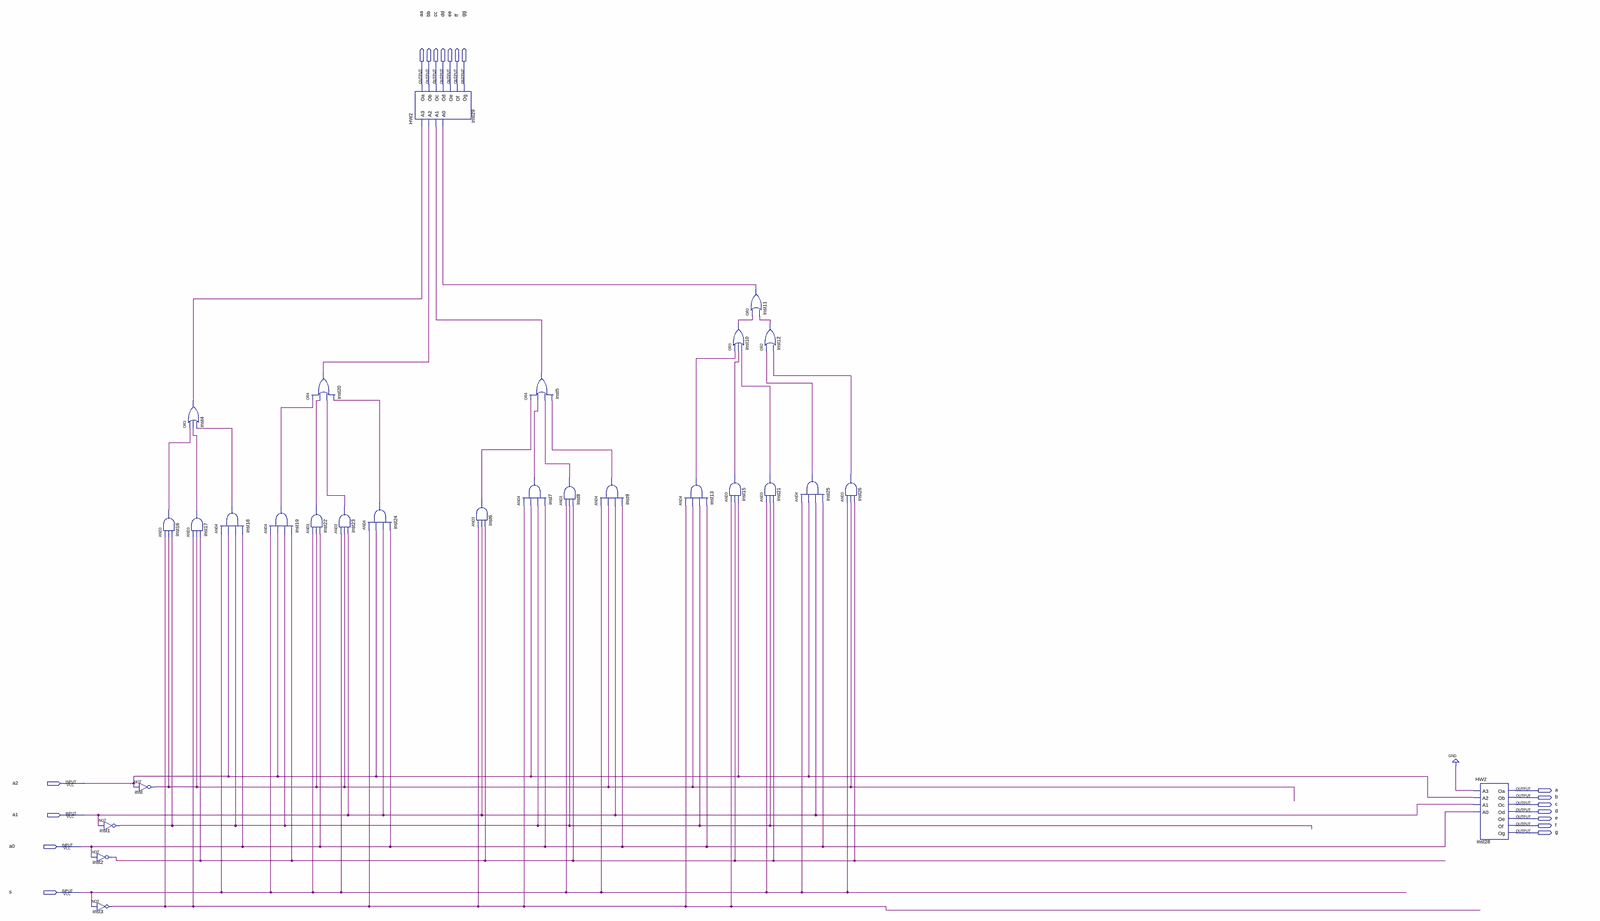
[diagram p0: schematic sheet, whole]
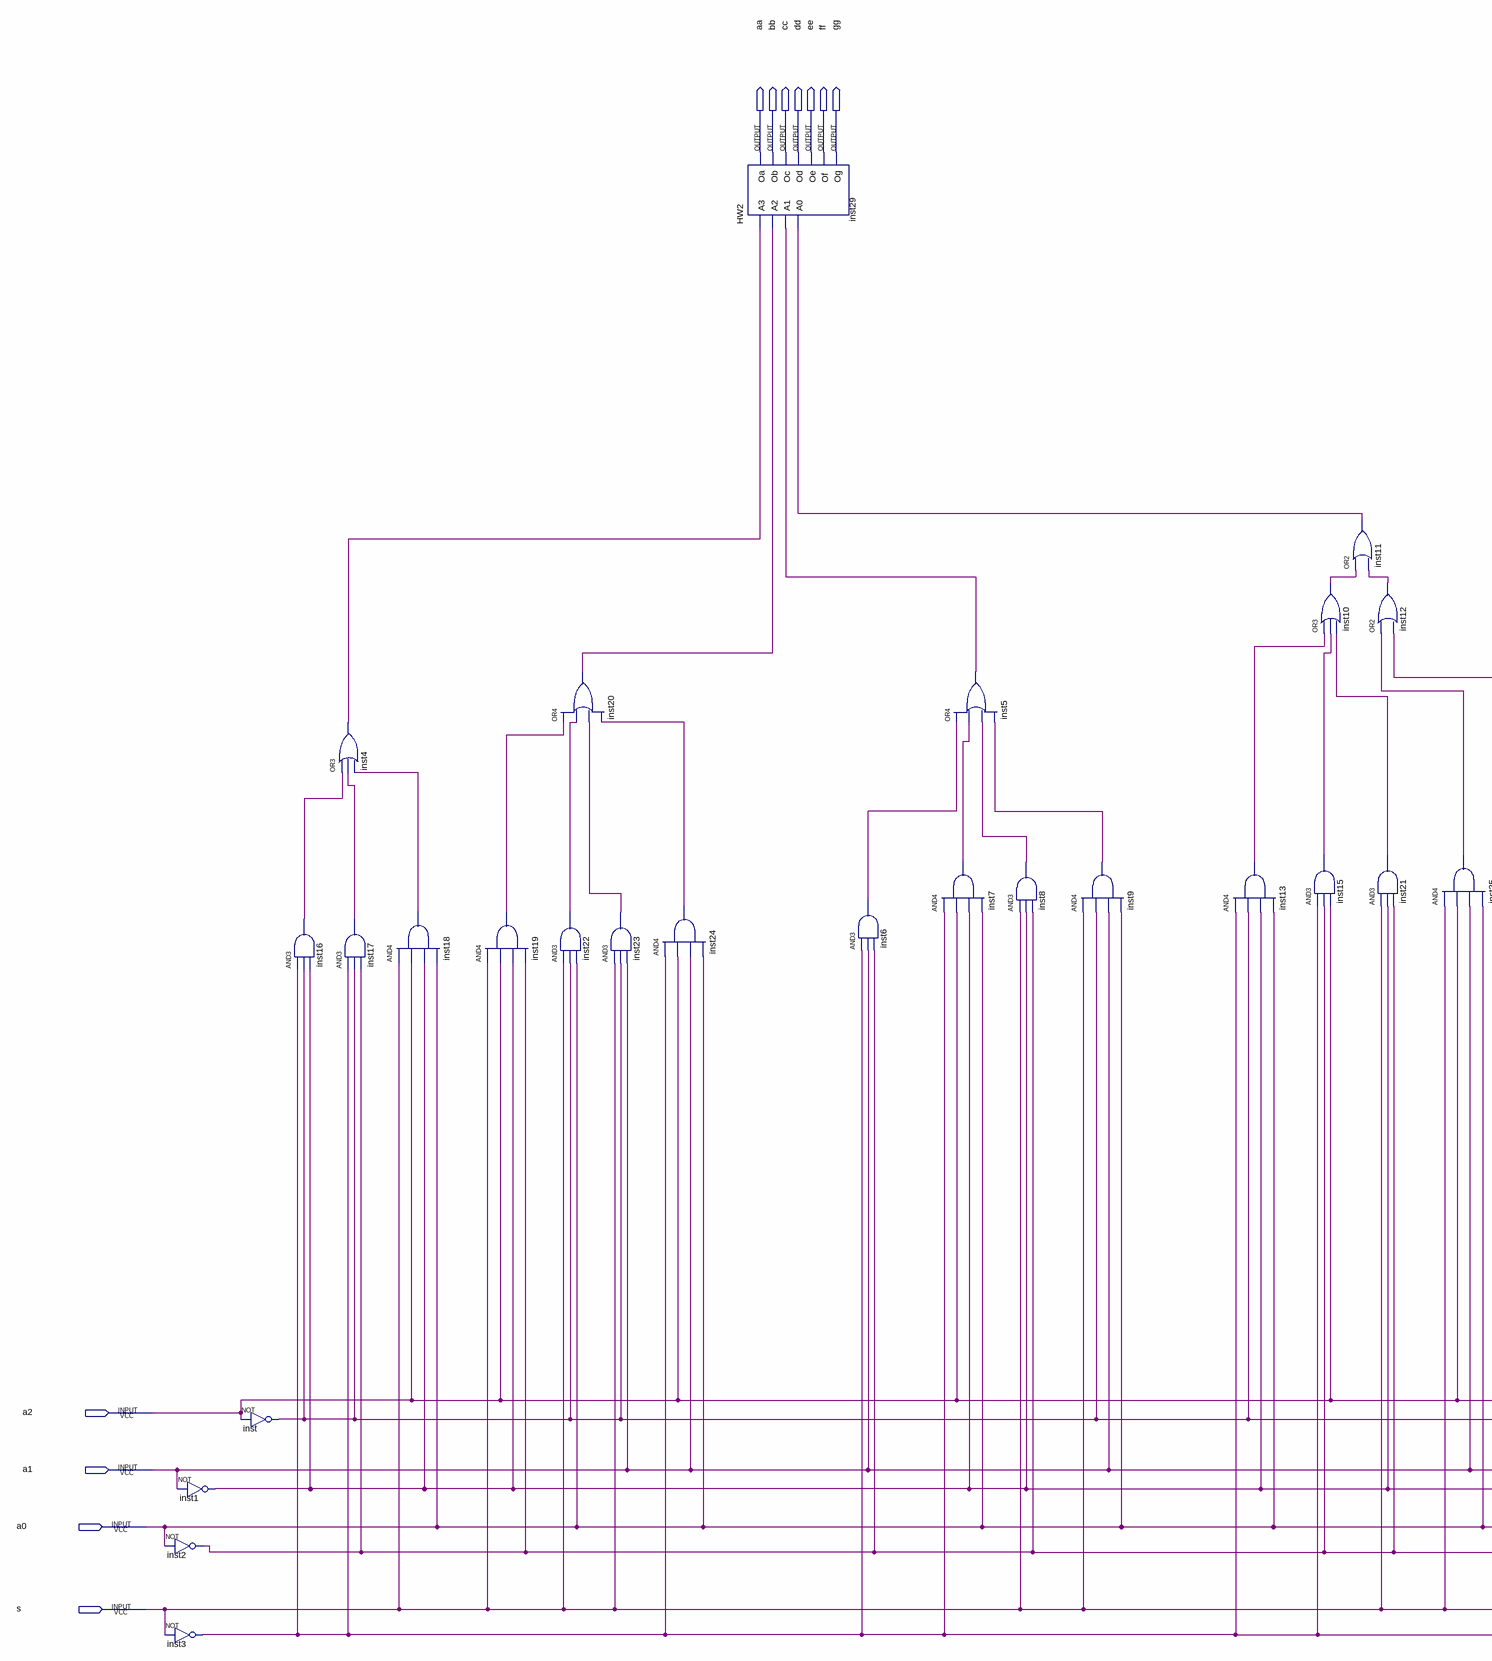
[diagram p1: schematic sheet, left part]
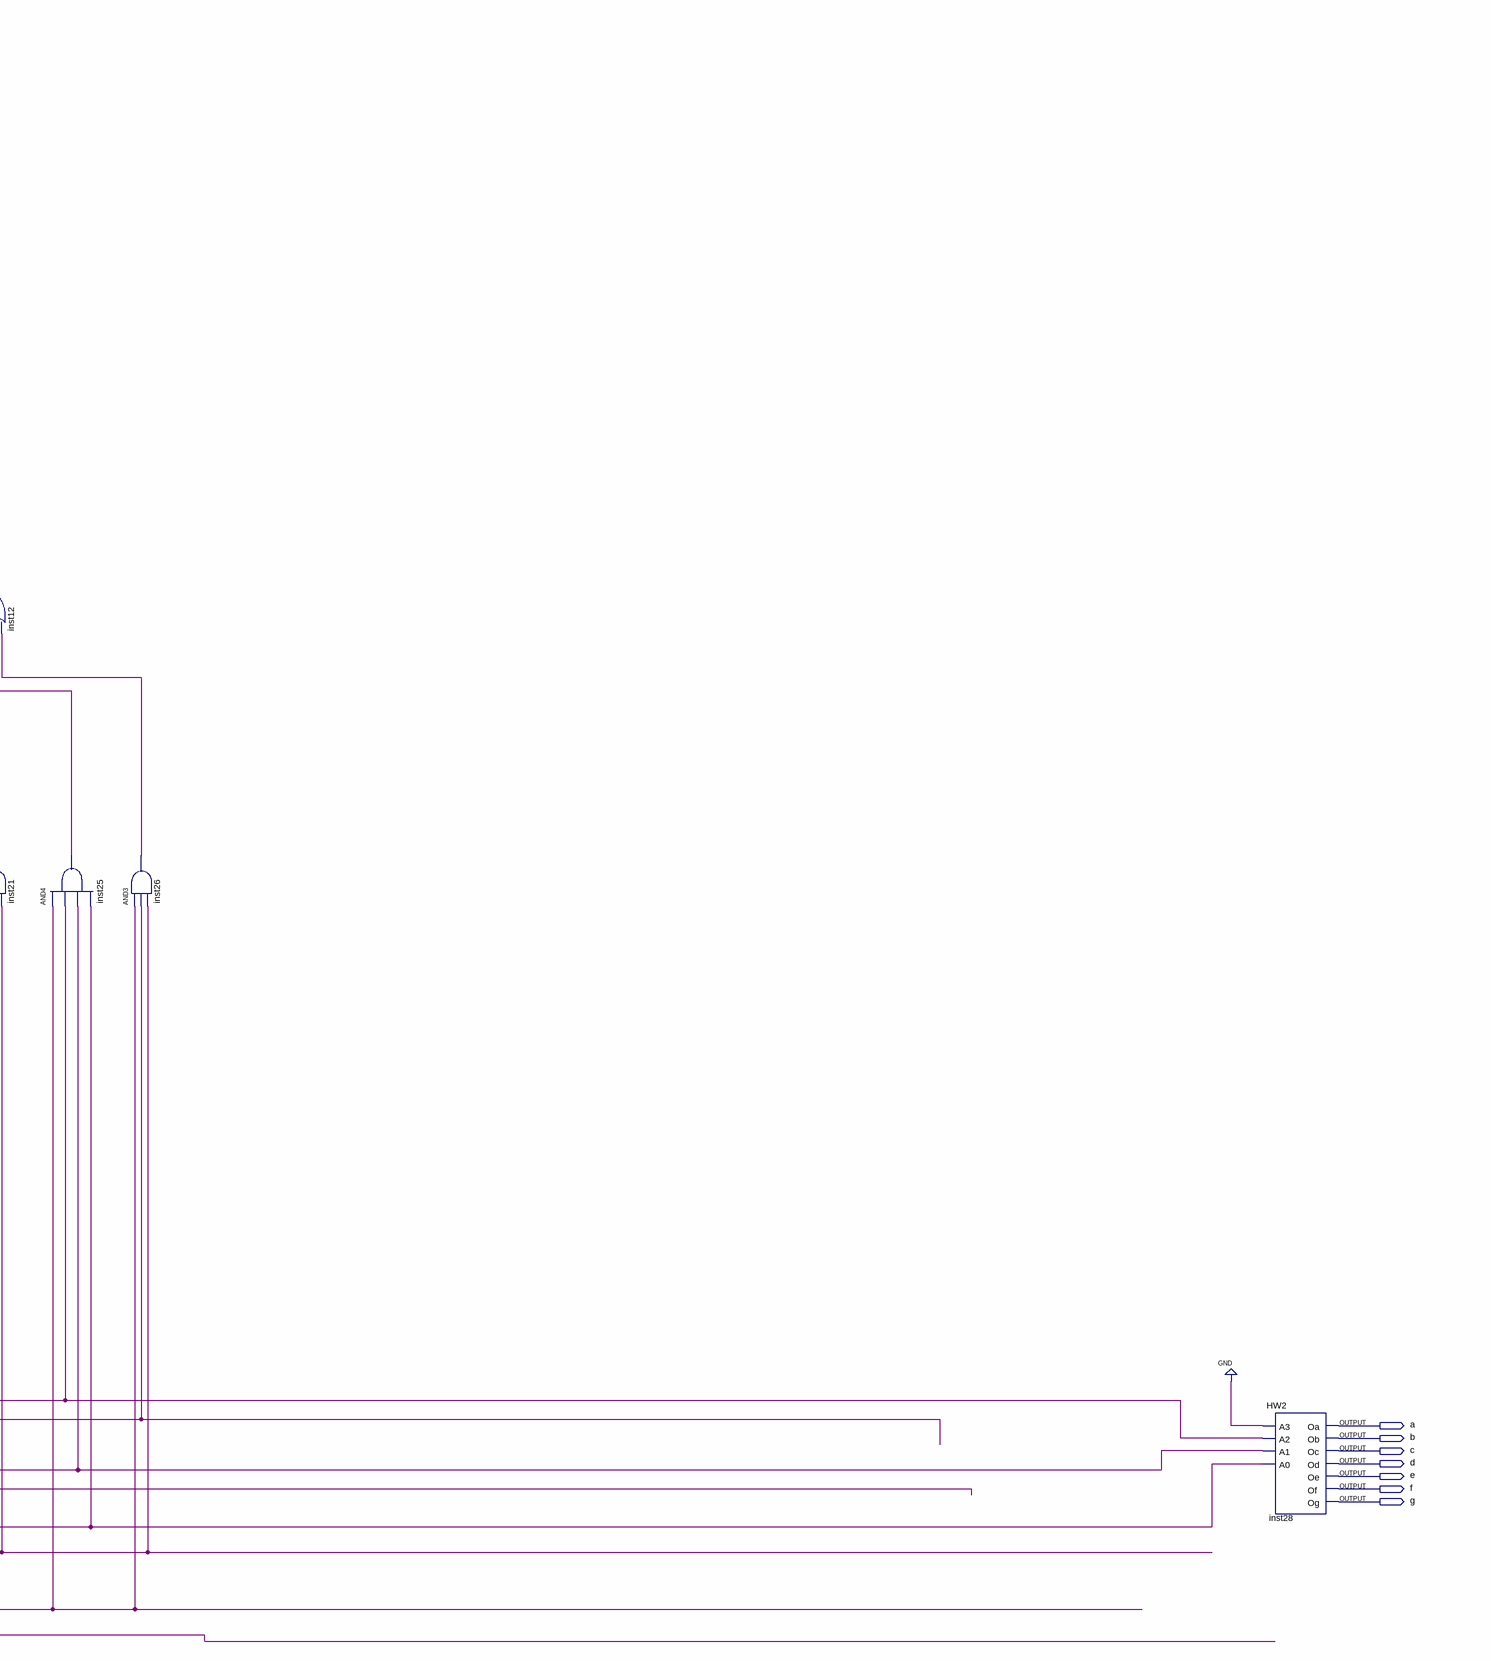
[diagram p2: schematic sheet, right part]
// Quartus schematic HW01.bdf as structural Verilog: 28 symbols, 18 pins
module HW01 (
  input  a2,
  input  a1,
  input  a0,
  input  s,
  output aa,
  output bb,
  output cc,
  output dd,
  output ee,
  output ff,
  output gg,
  output a,
  output b,
  output c,
  output d,
  output e,
  output f,
  output g
);

  wire inst1_out, inst2_out, inst3_out, inst4_out, inst5_out, inst6_out, inst7_out, inst8_out, inst9_out,
       inst10_out, inst11_out, inst12_out, inst13_out, inst15_out, inst16_out, inst17_out, inst18_out,
       inst19_out, inst20_out, inst21_out, inst22_out, inst23_out, inst24_out, inst25_out, inst26_out,
       inst_out;

  not inst1 (inst1_out, a1);
  not inst2 (inst2_out, a0);
  not inst3 (inst3_out, s);
  not inst (inst_out, a2);
  and inst16 (inst16_out, inst3_out, inst_out, inst1_out);
  or inst4 (inst4_out, inst16_out, inst17_out, inst18_out);
  and inst17 (inst17_out, inst3_out, inst_out, inst2_out);
  and inst18 (inst18_out, s, a2, inst1_out, a0);
  and inst19 (inst19_out, s, a2, inst1_out, inst2_out);
  or inst20 (inst20_out, inst19_out, inst22_out, inst23_out, inst24_out);
  and inst22 (inst22_out, s, inst_out, a0);
  and inst23 (inst23_out, s, inst_out, a1);
  and inst24 (inst24_out, inst3_out, a2, a1, a0);
  HW2 inst29 (
    .A3(inst4_out), .A2(inst20_out), .A1(inst5_out), .A0(inst11_out), .Oa(aa), .Ob(bb), .Oc(cc), .Od(dd),
    .Oe(ee), .Of(ff), .Og(gg));
  and inst6 (inst6_out, inst3_out, a1, inst2_out);
  or inst5 (inst5_out, inst6_out, inst7_out, inst8_out, inst9_out);
  and inst7 (inst7_out, inst3_out, a2, inst1_out, a0);
  and inst8 (inst8_out, s, inst1_out, inst2_out);
  and inst9 (inst9_out, s, inst_out, a1, a0);
  and inst13 (inst13_out, inst3_out, inst_out, inst1_out, a0);
  or inst10 (inst10_out, inst13_out, inst15_out, inst21_out);
  and inst15 (inst15_out, inst3_out, inst2_out, a2);
  or inst11 (inst11_out, inst10_out, inst12_out);
  or inst12 (inst12_out, inst25_out, inst26_out);
  and inst21 (inst21_out, s, inst1_out, inst2_out);
  and inst25 (inst25_out, s, a2, a1, a0);
  and inst26 (inst26_out, s, inst_out, inst2_out);
  HW2 inst28 (.A3(1'b0), .A2(a2), .A1(a1), .A0(a0), .Oa(a), .Ob(b), .Oc(c), .Od(d), .Oe(e), .Of(f), .Og(g));
endmodule
